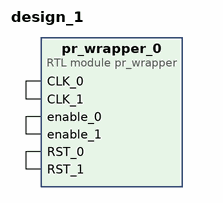
[diagram p0: block diagram of the top level]
# Vivado block design design_1, xc7z020clg400-2, Vivado 2018.3
create_bd_design design_1

create_bd_cell -type module -reference pr_wrapper pr_wrapper_0

# ---- connections ----

connect_bd_net [get_bd_pins pr_wrapper_0/CLK_0] [get_bd_pins pr_wrapper_0/CLK_1]
connect_bd_net [get_bd_pins pr_wrapper_0/RST_0] [get_bd_pins pr_wrapper_0/RST_1]
connect_bd_net [get_bd_pins pr_wrapper_0/enable_0] [get_bd_pins pr_wrapper_0/enable_1]

validate_bd_design
save_bd_design
